# Altium schematic sheet Sheet1.SchDoc
size A4; SheetNumber: 1; SheetTotal: 1
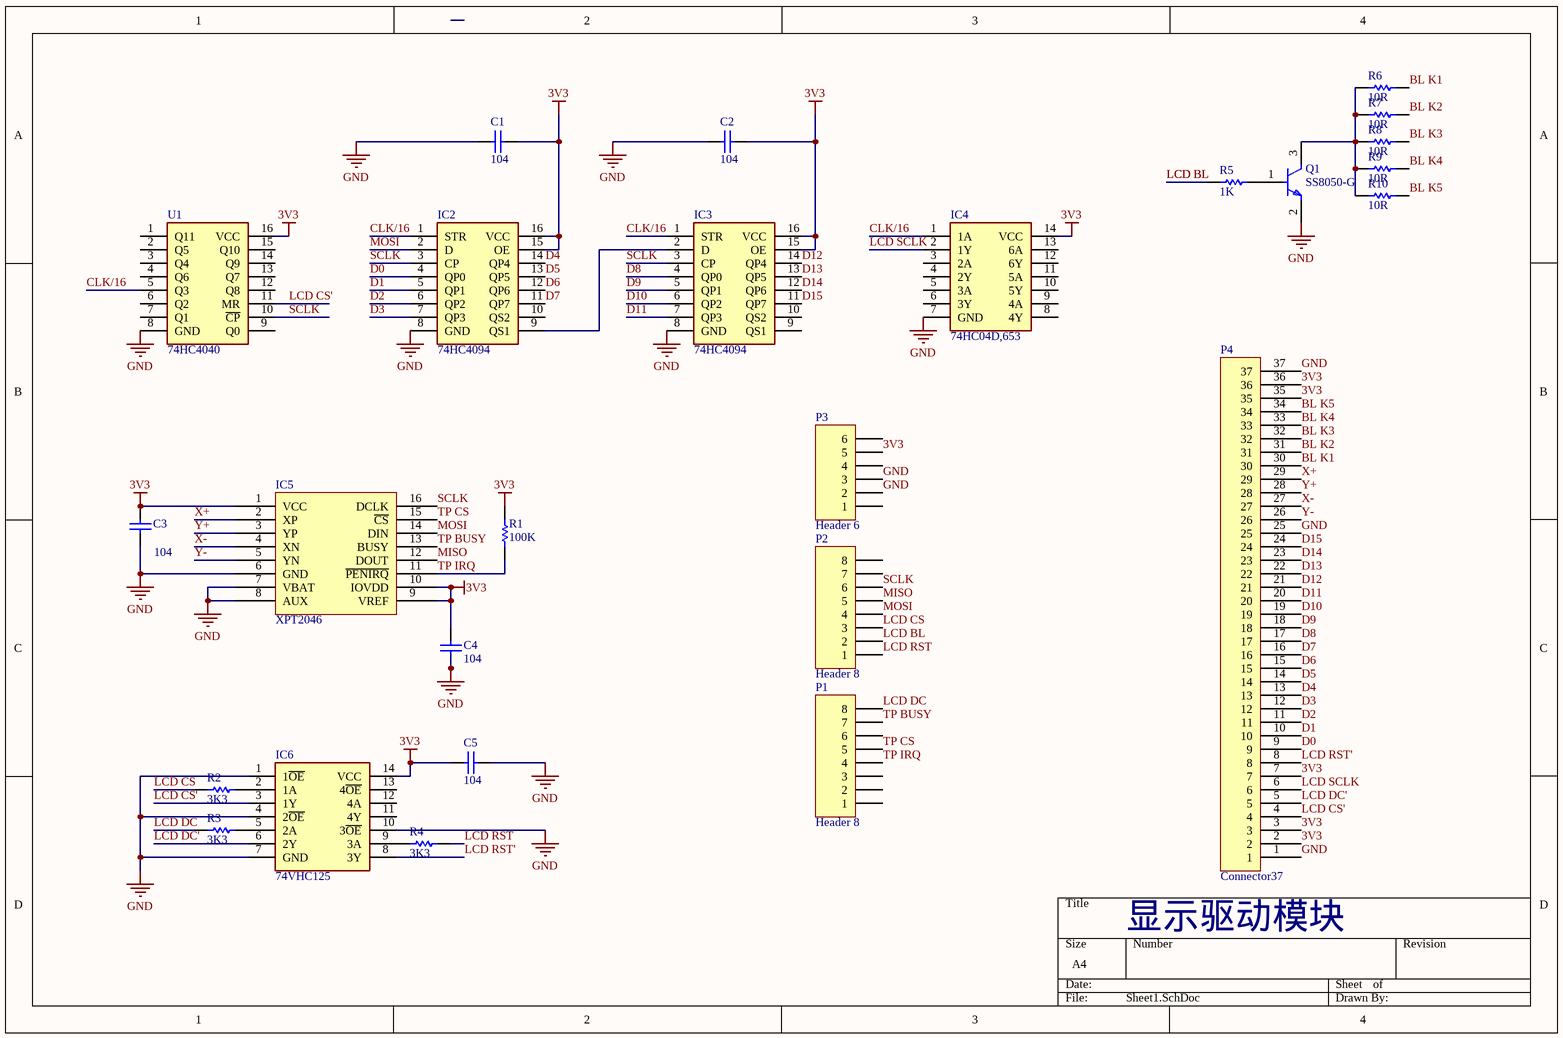
[diagram p0: Sheet1.SchDoc]

## Parts
C1  104  [CAPC2013X135X45LL10T25]
C2  104  [CAPC2013X135X45LL10T25]
C3  104  [CAPC2013X135X45LL10T25]
C4  104  [CAPC2013X135X45LL10T25]
C5  104  [CAPC2013X135X45LL10T25]
IC2  74HC4094  [74HC4094D653]
IC3  74HC4094  [74HC4094D653]
IC4  74HC04D,653  [SOIC127P600X175-14N]
IC5  XPT2046  [TSOP65P640X110-16N]
IC6  74VHC125  [SOP65P640X510-14N]
P1  Header 8  [HDR1X8]
P2  Header 8  [HDR1X8]
P3  Header 6  [HDR1X6]
P4  Connector37  [C37]
Q1  SS8050-G  [FP-SS8050-G-MFG]
R1  100K  [RESC2013X60X35ML10T20]
R2  3K3  [RESC2013X60X35ML10T20]
R3  3K3  [RESC2013X60X35ML10T20]
R4  3K3  [RESC2013X60X35ML10T20]
R5  1K  [RESC2013X60X35ML10T20]
R6  10R  [RESC2013X60X35ML10T20]
R7  10R  [RESC2013X60X35ML10T20]
R8  10R  [RESC2013X60X35ML10T20]
R9  10R  [RESC2013X60X35ML10T20]
R10  10R  [RESC2013X60X35ML10T20]
U1  74HC4040  [74HC4040D653]

## Nets
3V3: C1.2 C2.2 C3.1 C4.1 C5.1 IC2.15(OE) IC2.16(VCC) IC3.15(OE) IC3.16(VCC) IC4.14(VCC) IC5.1(VCC) IC5.9(VREF) IC5.10(IOVDD) IC6.14(VCC) P3.5 P4.2 P4.3 P4.7 P4.35 P4.36 R1.1 U1.16(VCC)
GND: C1.1 C2.1 C3.2 C4.2 C5.2 IC2.8(GND) IC3.8(GND) IC4.7(GND) IC5.6(GND) IC5.7(VBAT) IC5.8(AUX) IC6.1(1~{OE}) IC6.4(2~{OE}) IC6.7(GND) IC6.10(3~{OE}) P3.2 P3.3 P4.1 P4.25 P4.37 Q1.2(E) U1.8(GND)
BL K1: P4.30 R6.2
BL K2: P4.31 R7.2
BL K3: P4.32 R8.2
BL K4: P4.33 R9.2
BL K5: P4.34 R10.2
CLK/16: IC2.1(STR) IC3.1(STR) IC4.1(1A) U1.5(Q3)
D0: IC2.4(QP0) P4.9
D1: IC2.5(QP1) P4.10
D2: IC2.6(QP2) P4.11
D3: IC2.7(QP3) P4.12
D4: IC2.14(QP4) P4.13
D5: IC2.13(QP5) P4.14
D6: IC2.12(QP6) P4.15
D7: IC2.11(QP7) P4.16
D8: IC3.4(QP0) P4.17
D9: IC3.5(QP1) P4.18
D10: IC3.6(QP2) P4.19
D11: IC3.7(QP3) P4.20
D12: IC3.14(QP4) P4.21
D13: IC3.13(QP5) P4.22
D14: IC3.12(QP6) P4.23
D15: IC3.11(QP7) P4.24
LCD BL: P2.2 R5.1
LCD CS: P2.3 R2.1
LCD CS': IC6.3(1Y) P4.4 U1.11(MR)
LCD DC: P1.8 R3.1
LCD DC': IC6.6(2Y) P4.5
LCD RST: P2.1 R4.2
LCD RST': IC6.8(3Y) P4.8
LCD SCLK: IC4.2(1Y) P4.6
MISO: IC5.12(DOUT) P2.5
MOSI: IC2.2(D) IC5.14(DIN) P2.4
SCLK: IC2.3(CP) IC3.3(CP) IC5.16(DCLK) P2.6 U1.10(~{CP})
TP BUSY: IC5.13(BUSY) P1.7
TP CS: IC5.15(~{CS}) P1.5
TP IRQ: IC5.11(~{PENIRQ}) P1.4 R1.2
X+: IC5.2(XP) P4.29
X-: IC5.4(XN) P4.27
Y+: IC5.3(YP) P4.28
Y-: IC5.5(YN) P4.26
NetIC2_9: IC2.9(QS1) IC3.2(D)
NetIC6_2: IC6.2(1A) R2.2
NetIC6_5: IC6.5(2A) R3.2
NetIC6_9: IC6.9(3A) R4.1
NetQ1_1: Q1.1(B) R5.2
NetQ1_3: Q1.3(C) R6.1 R7.1 R8.1 R9.1 R10.1

Not connected (* = marked no-connect by the designer): IC2 10(QS2); IC3 9(QS1) 10(QS2); IC4 3(2A) 4(2Y) 5(3A) 6(3Y) 8(4Y) 9(4A) 10(5Y) 11(5A) 12(6Y) 13(6A); IC6 11(4Y) 12(4A) 13(4~{OE}); P1 1 2 3 6; P2 7 8; P3 1 4 6; U1 1(Q11) 2(Q5) 3(Q4) 4(Q6) 6(Q2) 7(Q1) 9(Q0) 12(Q8) 13(Q7) 14(Q9) 15(Q10)

## Notes on the sheet
- (near P4) 显示驱动模块

## Library data of the parts
C1-C5 = CMP-2007-03607-1: Manufacturer: Murata; Part Number: GRM21BR72E103KW03L
IC2 IC3 = 74HC4094D,653: Integrated Circuit; Manufacturer_Name: Nexperia; Datasheet Link: https://assets.nexperia.com/documents/data-sheet/74HC_HCT4094.pdf; Height: 1.75mm; Manufacturer_Part_Number: 74HC4094D,653; Mouser Part Number: 771-74HC4094D-T; Mouser Price/Stock: https://www.mouser.co.uk/ProductDetail/Nexperia/74HC4094D653?qs=P62ublwmbi%2FnjmcB1cThvQ%3D%3D; Arrow Part Number: 74HC4094D,653; Arrow Price/Stock: https://www.arrow.com/en/products/74hc4094d653/nexperia?region=nac
IC4 = 74HC04D,653: Integrated Circuit; Manufacturer_Name: Nexperia; Datasheet Link: https://assets.nexperia.com/documents/data-sheet/74HC_HCT04.pdf; Height: 1.75mm; Manufacturer_Part_Number: 74HC04D,653; Mouser Part Number: 771-74HC04D-T; Mouser Price/Stock: https://www.mouser.co.uk/ProductDetail/Nexperia/74HC04D653?qs=P62ublwmbi%252BLi7Vd8cc7xw%3D%3D; Arrow Part Number: 74HC04D,653; Arrow Price/Stock: https://www.arrow.com/en/products/74hc04d653/nexperia?region=nac
IC6 = 74VHC125D,118: Integrated Circuit; Manufacturer_Name: Nexperia; Datasheet Link: https://assets.nexperia.com/documents/data-sheet/74VHC_VHCT125.pdf; Height: 1.75mm; Manufacturer_Part_Number: 74VHC125D,118; Mouser Part Number: 771-74VHC125D118; Mouser Price/Stock: https://www.mouser.co.uk/ProductDetail/Nexperia/74VHC125D118?qs=jquClx72t9AbaQROblJdHA%3D%3D; Arrow Part Number: 74VHC125D,118; Arrow Price/Stock: https://www.arrow.com/en/products/74vhc125d118/nexperia?region=nac
P1 P2 = Header 8: Header, 8-Pin; LatestRevisionDate: 17-Jul-2002; LatestRevisionNote: Re-released for DXP Platform.; Publisher: Altium Limited
P3 = Header 6: Header, 6-Pin; LatestRevisionDate: 17-Jul-2002; LatestRevisionNote: Re-released for DXP Platform.; Publisher: Altium Limited
Q1 = CMP-20235-000001-1: NPN TRANSISTOR 1.5A 40V SOT-23 R; Transition Frequency: 100MHz; Max Breakdown Voltage: 25V; Collector Emitter Voltage (VCEO): 400mV; Max Power Dissipation: 300mW; Max Collector Current: 1.5A; Case/Package: TO-236-3; Packaging: Tape and Reel; RoHS Compliant: Yes; Mount: Surface Mount; Collector Emitter Breakdown Voltage: 25V
R1 = CMP-2100-03668-1: Chip Resistor, 100 KOhm, +/- 1%, 0.125 W, -55 to 155 degC, 0805 (2012 Metric), RoHS, Tape and Reel; Manufacturer: Yageo; Max Power Dissipation: 125mW; Voltage Rating: 150V; Temperature Coefficient: 100ppm/degreesC; Manufacturer URL: http://www.yageo.com/; Min Operating Temperature: -55degC; Lead Pitch: 0.4mm; Composition: ThickFilm; Case Code (Metric): 2012; Military Standard: Not; Package Description: 2-Pin Surface Mounted Device, Body 2 x 1.25 mm; REACH SVHC: Unknown; RoHSCompliant: true; Depth: 1.25mm; Number of Pins: 2; Lead Free: LeadFree; Resistance: 100KOhm; Datasheet URL: http://www.yageo.com/NewPortal/yageodocoutput?fileName=/pdf/R-Chip/PYu-RC_Group_51_RoHS_L_5.pdf; Max Operating Temperature: 155degC; Case/Package: 0805; Package Quantity: 1; Case Code (Imperial): 0805; Power Rating: 125mW; Width: 0.049inch; Package Reference: 0805; Height: 0.024inch; Termination: SMD/SMT; Tolerance: 1%; Datasheet Version: Rev. 5, 10/2016; Length: 2mm; Voltage Rating (DC): 150V; Number of Terminations: 2; Packaging: TapeandReel
R2-R5 = CMP-2100-03671-1: Chip Resistor, 1 KOhm, +/- 1%, 125 mW, -55 to 155 degC, 0805 (2012 Metric), RoHS, Tape and Reel; Manufacturer: Yageo; Temperature Coefficient: 100ppm/degreesC; Voltage Rating (DC): 150V; Max Power Dissipation: 125mW; Resistance: 1KOhm; Number of Pins: 2; Number of Terminations: 2; Datasheet URL: http://www.yageo.com/NewPortal/yageodocoutput?fileName=/pdf/R-Chip/PYu-RC_Group_51_RoHS_L_5.pdf; Length: 0.079inch; Package Description: 2-Pin Surface Mounted Device, Body 2 x 1.25 mm; Depth: 1.25mm; Height: 0.024inch; Military Standard: Not; Case/Package: 0805; Package Reference: 0805; RoHSCompliant: true; Lead Free: LeadFree; Packaging: TapeandReel; Package Quantity: 1; Datasheet Version: Rev. 5, 10/2016; Tolerance: 1%; Min Operating Temperature: -55degC; Voltage Rating: 150V; Composition: ThickFilm; Case Code (Imperial): 0805; Power Rating: 125mW; Width: 0.049inch; Case Code (Metric): 2012; Manufacturer URL: http://www.yageo.com/; Max Operating Temperature: 155degC; REACH SVHC: Unknown; Termination: SMD/SMT
R6-R10 = CMP-2100-03670-1: Chip Resistor, 10 Ohm, +/- 1%, 0.125 W, -55 to 155 degC, 0805 (2012 Metric), RoHS, Tape and Reel; Manufacturer: Yageo; Resistance: 10Ohm; Power Rating: 125mW; Voltage Rating: 150V; Temperature Coefficient: 200ppm/degreesC; Number of Pins: 2; REACH SVHC: NoSVHC; Datasheet Version: Rev. 5, 10/2016; Max Operating Temperature: 155degC; Manufacturer URL: http://www.yageo.com/; Case Code (Imperial): 0805; Package Description: 2-Pin Surface Mounted Device, Body 2 x 1.25 mm; Case Code (Metric): 2012; Length: 2mm; RoHSCompliant: true; Max Power Dissipation: 125mW; Depth: 1.25mm; Packaging: TapeandReel; Height: 0.5mm; Package Reference: 0805; Package Quantity: 1; Tolerance: 1%; Termination: SMD/SMT; Min Operating Temperature: -55degC; Lead Free: LeadFree; Width: 1.25mm; Voltage Rating (DC): 150V; Datasheet URL: http://www.yageo.com/NewPortal/yageodocoutput?fileName=/pdf/R-Chip/PYu-RC_Group_51_RoHS_L_5.pdf; Composition: ThickFilm; Number of Terminations: 2; Case/Package: 0805
U1 = 74HC4040D,653: Integrated Circuit; Manufacturer_Name: Nexperia; Datasheet Link: https://assets.nexperia.com/documents/data-sheet/74HC_HCT4040.pdf; Height: 1.75mm; Manufacturer_Part_Number: 74HC4040D,653; Mouser Part Number: 771-74HC4040D-T; Mouser Price/Stock: https://www.mouser.co.uk/ProductDetail/Nexperia/74HC4040D653?qs=P62ublwmbi8%2FEE5KxYGUDg%3D%3D; Arrow Part Number: 74HC4040D,653; Arrow Price/Stock: https://www.arrow.com/en/products/74hc4040d653/nexperia